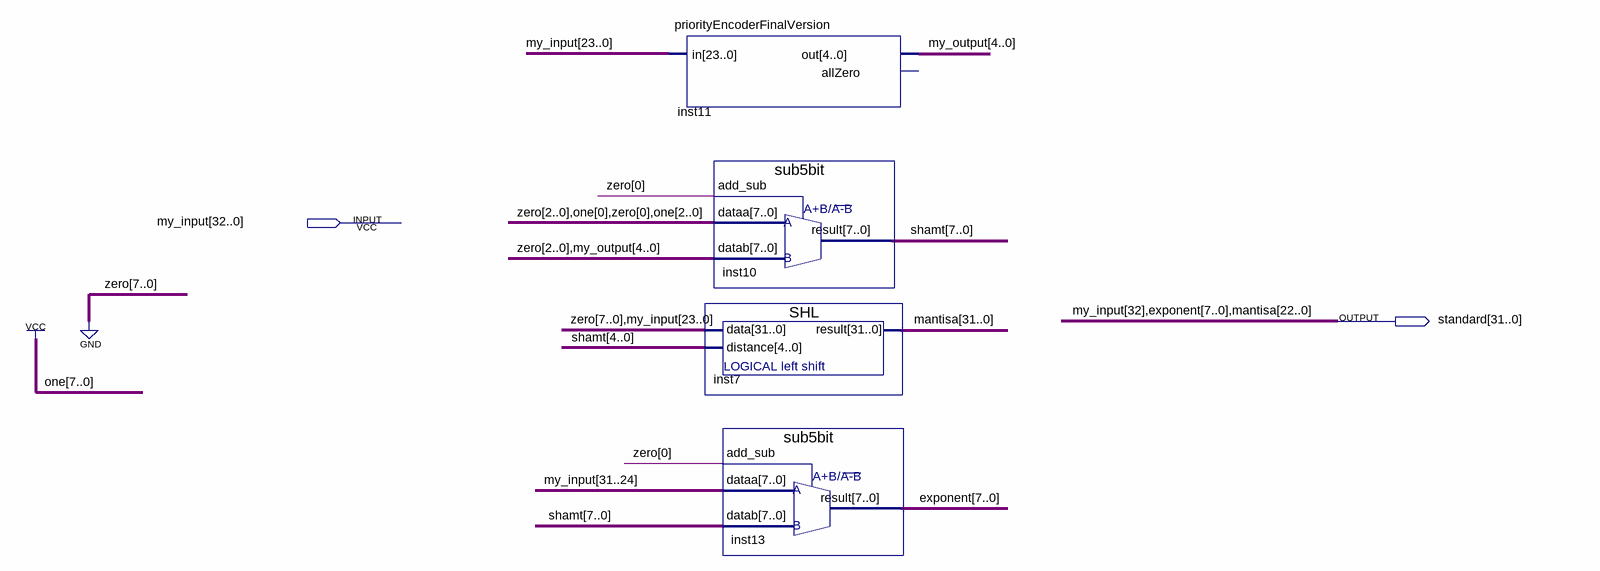
[diagram p0: schematic sheet]
// Quartus schematic mantisa_standarder.bdf as structural Verilog: 4 symbols, 2 pins
module mantisa_standarder (
  input  [32:0] my_input,
  output [31:0] standard
);

  wire [4:0] my_output;
  wire [7:0] shamt;
  wire [31:23] mantisa;

  priorityEncoderFinalVersion inst11 (.in(my_input[23:0]), .out(my_output));  // open: allZero
  sub5bit inst10 (.add_sub(1'b0), .dataa(8'b00010111), .datab({3'b000, my_output}), .result(shamt));
  SHL inst7 (.data({{8{1'b0}}, my_input[23:0]}), .distance(shamt[4:0]), .result({mantisa, standard[22:0]}));
  sub5bit inst13 (.add_sub(1'b0), .dataa(my_input[31:24]), .datab(shamt), .result(standard[30:23]));

  assign standard[31] = my_input[32];

  // Other names for the same wires on the sheet: exponent[7:0] = standard[30:23]; mantisa[22:0] = standard[22:0]
endmodule
